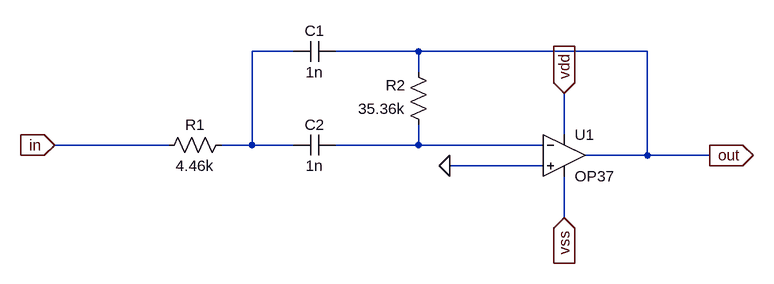
[diagram p0: schematic etj2.asc]
etj2.asc, the LTspice schematic file:
Version 4
SHEET 1 992 680
WIRE 256 -64 192 -64
WIRE 448 -64 320 -64
WIRE 800 -64 448 -64
WIRE 448 -32 448 -64
WIRE 672 64 672 0
WIRE 64 80 -112 80
WIRE 192 80 192 -64
WIRE 192 80 144 80
WIRE 256 80 192 80
WIRE 448 80 448 48
WIRE 448 80 320 80
WIRE 640 80 448 80
WIRE 800 96 800 -64
WIRE 800 96 704 96
WIRE 896 96 800 96
WIRE 640 112 496 112
WIRE 672 192 672 128
FLAG 496 112 0
FLAG -112 80 in
IOPIN -112 80 In
FLAG 896 96 out
IOPIN 896 96 Out
FLAG 672 0 vdd
IOPIN 672 0 In
FLAG 672 192 vss
IOPIN 672 192 In
DATAFLAG 224 80 ""
DATAFLAG 496 80 ""
DATAFLAG 576 112 ""
DATAFLAG 768 96 ""
SYMBOL cap 320 -48 M270
WINDOW 0 32 32 VTop 2
WINDOW 3 0 32 VBottom 2
SYMATTR InstName C1
SYMATTR Value 1n
SYMBOL res 160 64 R90
WINDOW 0 0 56 VBottom 2
WINDOW 3 32 56 VTop 2
SYMATTR InstName R1
SYMATTR Value 4.46k
SYMBOL res 464 64 R180
WINDOW 0 36 76 Left 2
WINDOW 3 36 40 Left 2
SYMATTR InstName R2
SYMATTR Value 35.36k
SYMBOL cap 256 96 R270
WINDOW 0 32 32 VTop 2
WINDOW 3 0 32 VBottom 2
SYMATTR InstName C2
SYMATTR Value 1n
SYMBOL OpAmps\\OP37 672 32 R0
SYMATTR InstName U1

The netlist it stands for:
* etj2.asc
C1 out N001 1n
R1 N001 in 4.46k
R2 N002 out 35.36k
C2 N001 N002 1n
XU1 0 N002 vdd vss out LT1037  ; OP37, pins In+ In- V+ V- OUT
.lib LTC.lib
.backanno
.end